# EAGLE design board2 (EAGLE 9.6.2)
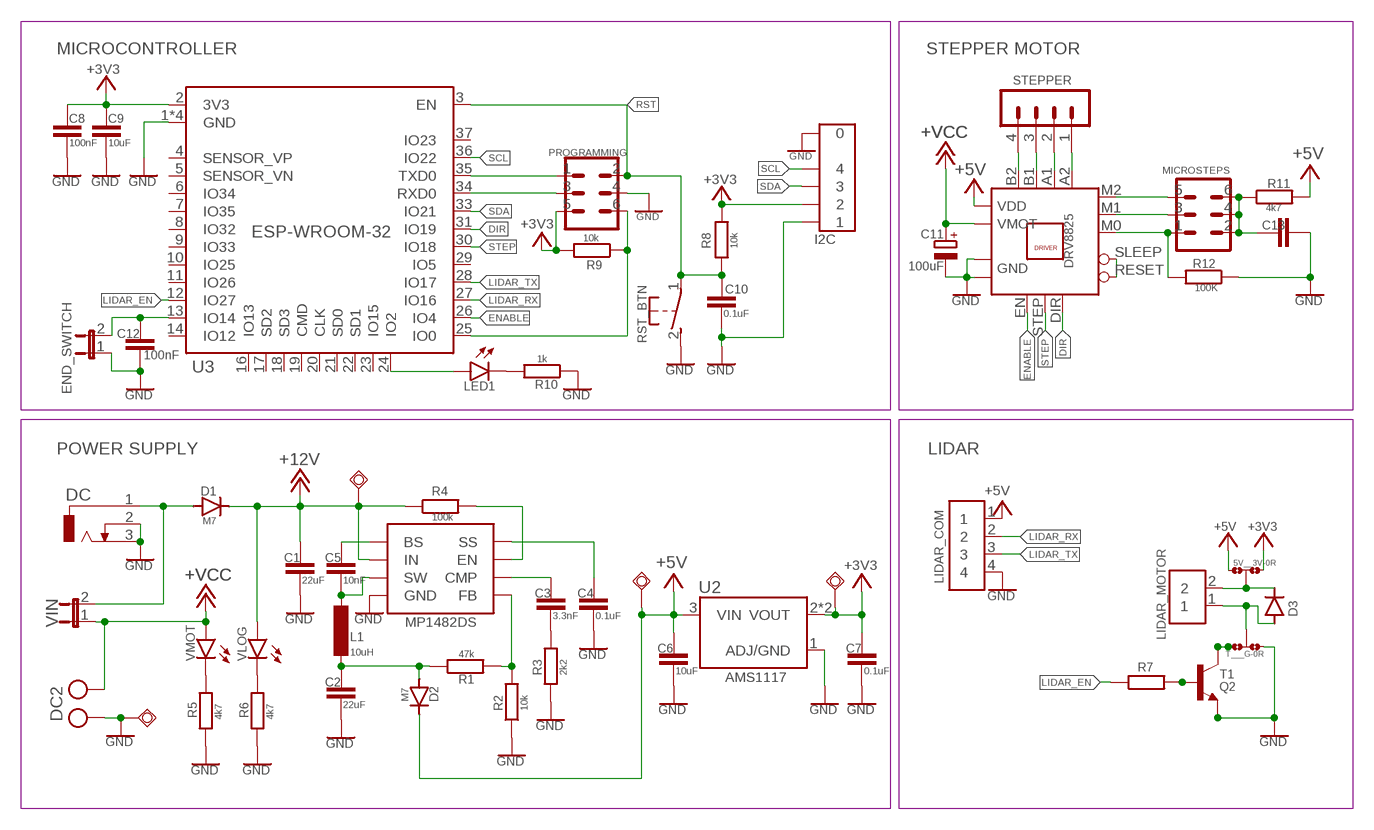
[diagram p0: schematic, sheet 1]

## Parts
3V3  TPSQTP07R  [TP07R]
5V  TPSQTP07R  [TP07R]
5V__3V  0R-JUMPA  [A0R-JMP]
12V  TPSQTP07R  [TP07R]
C1  22uF  C-EUC1210K  [C1210K]
C2  22uF  C-EUC1210K  [C1210K]
C3  3.3nF  C-EUC0805K  [C0805K]
C4  0.1uF  C-EUC0805K  [C0805K]
C5  10nF  C-EUC0805K  [C0805K]
C6  10uF  C-EUC1210K  [C1210K]
C7  0.1uF  C-EUC1210K  [C1210K]
C8  100nF  C-EUC0805K  [C0805K]
C9  10uF  C-EUC1210K  [C1210K]
C10  0.1uF  C-EUC0805K  [C0805K]
C11  100uF  CPOL-EUE3.5-8  [E3,5-8]
C12  100nF  C-EUC0805K  [C0805K]
C13  C-EUC0805K  [C0805K]
D1  M7  DIODE-DO-214AC  [DO-214AC]
D2  M7  DIODE-DO-214AC  [DO-214AC]
D3  M7  DIODE-DO-214AC  [DO-214AC]
DC  DCJ0202  [DCJ0202]
DC2  DC2  AK500/2-H  [AK500/2-H]
DRIVER  DRV8825_PCB  [DRV8825_PCB]
DRV8825  DRV8825_H  [DRV8825_H]
END_SWITCH  END_SWITCH  JP1E  [JP1]
GND  TPSQTP07R  [TP07R]
I2C  SM04B-SRSS-TB(LF)(SN)  [JST_SM04B-SRSS-TB(LF)(SN)]
L1  10uH  L-EUL5650M  [L5650M]
LED1  0  LEDCHIP-LED0805  [CHIP-LED0805]
LIDAR_COM  4PIN  [B4B-PH-K-S]
LIDAR_MOTOR  2PIN  [B2B-PH-K-S]
MICROSTEPS  MicroSteps  MA03-2  [MA03-2]
PROGRAMMING  Programming  MA03-2  [MA03-2]
Q2  BC846ALT1SMD  [SOT23]
R1  47k  R-EU_R0805W  [R0805W]
R2  10k  R-EU_R0805W  [R0805W]
R3  2k2  R-EU_R0805W  [R0805W]
R4  100k  R-EU_R0805W  [R0805W]
R5  4k7  R-EU_R0805W  [R0805W]
R6  4k7  R-EU_R0805W  [R0805W]
R7  R  R-EU_R0805W  [R0805W]
R8  10k  R-EU_R0805W  [R0805W]
R9  10k  R-EU_R0805W  [R0805W]
R10  1k  R-EU_R0805W  [R0805W]
R11  4k7  R-EU_R0805W  [R0805W]
R12  100K  R-EU_R0805W  [R0805W]
RST_BTN  DTSM-3  [DTSM-3]
STEPPER  Stepper  MA04-1  [MA04-1]
T1  BD139_BCXXX  BDBC  [TO126+TO92]
T___G  0R-JUMPB  [B0R-JMP]
U1  MP1482DS  [SOIC127P600X175-8N]
U2  AMS1117  [SOT229P700X180-4N]
U3  ESP-WROOM-32  [ESP-WROOM-32]
VIN  JUMPER  JP1E  [JP1]
VLOG  00  LEDCHIP-LED0805  [CHIP-LED0805]
VMOT  00  LEDCHIP-LED0805  [CHIP-LED0805]

## Nets
+3V3: 3V3.TP 5V__3V.1 5V__3V.2 C7.1 C8.1 C9.1 D3.C I2C.2 LIDAR_MOTOR.2 PROGRAMMING.5 R8.1 R9.2 U2.2(VOUT) U2.4(VOUT) U3.2(3V3)
+5V: 5V.TP 5V__3V.3 C6.2 D2.C DRV8825.FAULT(VDD) LIDAR_COM.1 R11.2 U2.3(VIN)
+12V: 12V.TP C1.2 D1.C R4.1 U1.2(IN) VLOG.A
+VCC: C11.+ DC2.2 DRV8825.VMOT DRV8825.VMOT1(VMOT) VIN.1 VMOT.A
A1: DRV8825.A1 STEPPER.2
A2: DRV8825.A2 STEPPER.1
B1: DRV8825.B1 STEPPER.3
B2: DRV8825.B2 STEPPER.4
BS: C5.2 U1.1(BS)
CMP: C3.2 U1.6(CMP)
DIR: DRV8825.DIR U3.31(IO19)
EN: R4.2 U1.7(EN)
ENABLE: DRV8825.EN U3.26(IO4)
END_SW: C12.2 END_SWITCH.2 U3.13(IO14)
GND: C1.1 C2.2 C4.1 C6.1 C7.2 C8.2 C9.2 C10.2 C11.- C12.1 C13.2 DC2.1 DC.2 DC.3 DRV8825.GND DRV8825.GND1(GMOT) END_SWITCH.1 GND.TP I2C.1 I2C.S1 I2C.S2 LIDAR_COM.4 PROGRAMMING.4 Q2.2(E) R2.1 R3.1 R5.1 R6.1 R10.1 R12.1 RST_BTN.2 T1.E T1.E1(E) T___G.3 U1.4(GND) U2.1(ADJ/GND) U3.1(GND) U3.15(GND) U3.38(GND) U3.GND
IO0: PROGRAMMING.6 R9.1 U3.25(IO0)
IO2: LED1.A U3.24(IO2)
LIDAR_EN: R7.1 U3.12(IO27)
LIDAR_RX: LIDAR_COM.2 U3.27(IO16)
LIDAR_TX: LIDAR_COM.3 U3.28(IO17)
M0: DRV8825.M0 MICROSTEPS.1 R12.2
M1: DRV8825.M1 MICROSTEPS.3
M2: DRV8825.M2 MICROSTEPS.5
MT: D3.A LIDAR_MOTOR.1 T___G.2
N$1: C2.1 D2.A L1.1 R1.1
N$2: C3.1 R3.2
N$3: R5.2 VMOT.C
N$4: Q2.3(C) T1.C T___G.1
N$5: C13.1 MICROSTEPS.2 MICROSTEPS.4 MICROSTEPS.6 R11.1
N$6: LED1.C R10.2
N$7: R6.2 VLOG.C
N$8: R1.2 R2.2 U1.5(FB)
N$9: DRV8825.RESET DRV8825.SLEEP
N$12: Q2.1(B) R7.2 T1.B
RST: C10.1 PROGRAMMING.2 R8.2 RST_BTN.1 U3.3(EN)
RXD: PROGRAMMING.3 U3.34(RXD0)
SCL: I2C.4 U3.36(IO22)
SDA: I2C.3 U3.33(IO21)
SS: C4.2 U1.8(SS)
STEP: DRV8825.STEP U3.30(IO18)
SW: C5.1 L1.2 U1.3(SW)
TXD: PROGRAMMING.1 U3.35(TXD0)
VIN: D1.A DC.1 VIN.2
Unconnected: U3.4(SENSOR_VP) U3.5(SENSOR_VN) U3.6(IO34) U3.7(IO35) U3.8(IO32) U3.9(IO33) U3.10(IO25) U3.11(IO26) U3.14(IO12) U3.16(IO13) U3.17(SD2) U3.18(SD3) U3.19(CMD) U3.20(CLK) U3.21(SD0) U3.22(SD1) U3.23(IO15) U3.29(IO5) U3.37(IO23)

## Notes on the sheet
- MICROCONTROLLER | STEPPER MOTOR
- POWER SUPPLY | LIDAR

## Library data of the parts
3V3 5V 12V GND = testpad:TPSQ: Test pad
5V__3V T___G = jump-0r-smd:0R-JUMP: SMD 0R 0805 Jumper
C1-C10 C12 C13 = rcl:C-EU: CAPACITOR, European symbol; SPICEPREFIX: C
C11 = rcl:CPOL-EU: POLARIZED CAPACITOR, European symbol; SPICEPREFIX: C
D1-D3 = diode:DIODE-: DIODE
DC = con-jack:DCJ0202: DC POWER JACK Source: DCJ0202.pdf; OC_FARNELL: unknown; OC_NEWARK: unknown
DC2 = con-ptr500:AK500/2-H: CONNECTOR Aug. 2004 / PTR Meßtechnik: Die Bezeichnung der Serie AK505 wurde geändert. Es handelt sich hierbei um AK500 in horizontaler Ausführung.; OC_FARNELL: unknown; OC_NEWARK: unknown
DRIVER = drv8825:DRV8825_PCB
DRV8825 = drv8825:DRV8825_H
END_SWITCH VIN = jumper:JP1E: JUMPER
I2C = SM04B-SRSS-TB_LF__SN_:SM04B-SRSS-TB(LF)(SN): SH Series 1.0 mm Pitch 2 Position Single Row Side Entry Shrouded Header Check availability <https://pricing.snapeda.com/parts/SM04B-SRSS-TB%28LF%29%28SN%29/JST%20Sales/view-part?ref=eda>; AVAILABILITY: In Stock; DESCRIPTION: Connector Header Surface Mount, Right Angle 4 position 0.039 (1.00mm); MF: JST Sales; MP: SM04B-SRSS-TB(LF)(SN); PACKAGE: None; PRICE: None; PURCHASE-URL: https://pricing.snapeda.com/search?q=SM04B-SRSS-TB(LF)(SN)&ref=eda
L1 = rcl:L-EU: INDUCTOR, European symbol; SPICEPREFIX: L
LED1 VLOG VMOT = led:LED: LED OSRAM: - CHIPLED LG R971, LG N971, LY N971, LG Q971, LY Q971, LO R971, LY R971 LH N974, LH R974 LS Q976, LO Q976, LY Q976 LO Q996 - Hyper CHIPLED LW Q18S LB Q993, LB Q99A, LB R99A - SideLED LS A670, LO A670, LY A670, LG A670, LP A670 LB A673, LV A673, LT A673, LW A673 LH A674 LY A675 LS A676, LA A676, LO A676, LY A676, LW A676 LS A679, LY A679, LG A679 - Hyper Micro SIDELED® LS Y876, LA Y876, LO Y876, LY Y876 LT Y87S - SmartLED LW L88C, LW L88S LB L89C, LB L89S, LG L890 LS L89K, LO L89K, LY L89K LS L896, LA L896, LO L896, LY L896 - TOPLED LS T670, LO T670, LY T670, LG T670, LP T670 LSG T670, LSP T670, LSY T670, LOP T670, LYG T670 LG T671, LOG T671, LSG T671 LB T673, LV T673, LT T673, LW T673 LH T674 LS T676, LA T676, LO T676, LY T676, LB T676, LH T676, LSB T676, LW T676 LB T67C, LV T67C, LT T67C, LS T67K, LO T67K, LY T67K, LW E67C LS E67B, LA E67B, LO E67B, LY E67B, LB E67C, LV E67C, LT E67C LW T67C LS T679, LY T679, LG T679 LS T770, LO T770, LY T770, LG T770, LP T770 LB T773, LV T773, LT T773, LW T773 LH T774 LS E675, LA E675, LY E675, LS T675 LS T776, LA T776, LO T776, LY T776, LB T776 LHGB T686 LT T68C, LB T68C - Hyper Mini TOPLED® LB M676 - Mini TOPLED Santana® LG M470 LS M47K, LO M47K, LY M47K Source: http://www.osram.convergy.de LUXEON: - LUMILED® LXK2-PW12-R00, LXK2-PW12-S00, LXK2-PW14-U00, LXK2-PW14-V00 LXK2-PM12-R00, LXK2-PM12-S00, LXK2-PM14-U00 LXK2-PE12-Q00, LXK2-PE12-R00, LXK2-PE12-S00, LXK2-PE14-T00, LXK2-PE14-U00 LXK2-PB12-K00, LXK2-PB12-L00, LXK2-PB12-M00, LXK2-PB14-N00, LXK2-PB14-P00, LXK2-PB14-Q00 LXK2-PR12-L00, LXK2-PR12-M00, LXK2-PR14-Q00, LXK2-PR14-R00 LXK2-PD12-Q00, LXK2-PD12-R00, LXK2-PD12-S00 LXK2-PH12-R00, LXK2-PH12-S00 LXK2-PL12-P00, LXK2-PL12-Q00, LXK2-PL12-R00 Source: www.luxeon.com KINGBRIGHT: KA-3528ASYC Source: www.kingbright.com
LIDAR_COM = jst_eph:4PIN
LIDAR_MOTOR = jst_eph:2PIN
MICROSTEPS PROGRAMMING = con-lstb:MA03-2: PIN HEADER; OC_FARNELL: unknown; OC_NEWARK: unknown
Q2 = transistor-npn:BC846*: NPN Transistor
R1-R12 = rcl:R-EU_: RESISTOR, European symbol; SPICEPREFIX: R
RST_BTN = switch-tact:DTSM-3
STEPPER = con-lstb:MA04-1: PIN HEADER; OC_FARNELL: unknown; OC_NEWARK: unknown
T1 = transistor-power:BDBC
U1 = SOIC127P600X175-8N:MP1482DS; MP1482DS: MP1482DS
U2 = AMS1117:AMS1117: Sot223/Pkg 1-Amp 5-Volt Low Drop Out Voltage Regulatator Check availability <https://pricing.snapeda.com/parts/AMS1117/Advanced%20Monolithic%20Systems/view-part?ref=eda>; AVAILABILITY: Not in stock; DESCRIPTION: 1A LOW DROPOUT VOLTAGE REGULATOR SOT-223; MF: Advanced Monolithic Systems; MP: AMS1117; PACKAGE: SOT-223 Seeed Technology; PRICE: None
U3 = esp32_smd:ESP-WROOM-32: Espressif Systems ESP-WROOM-32

## Board
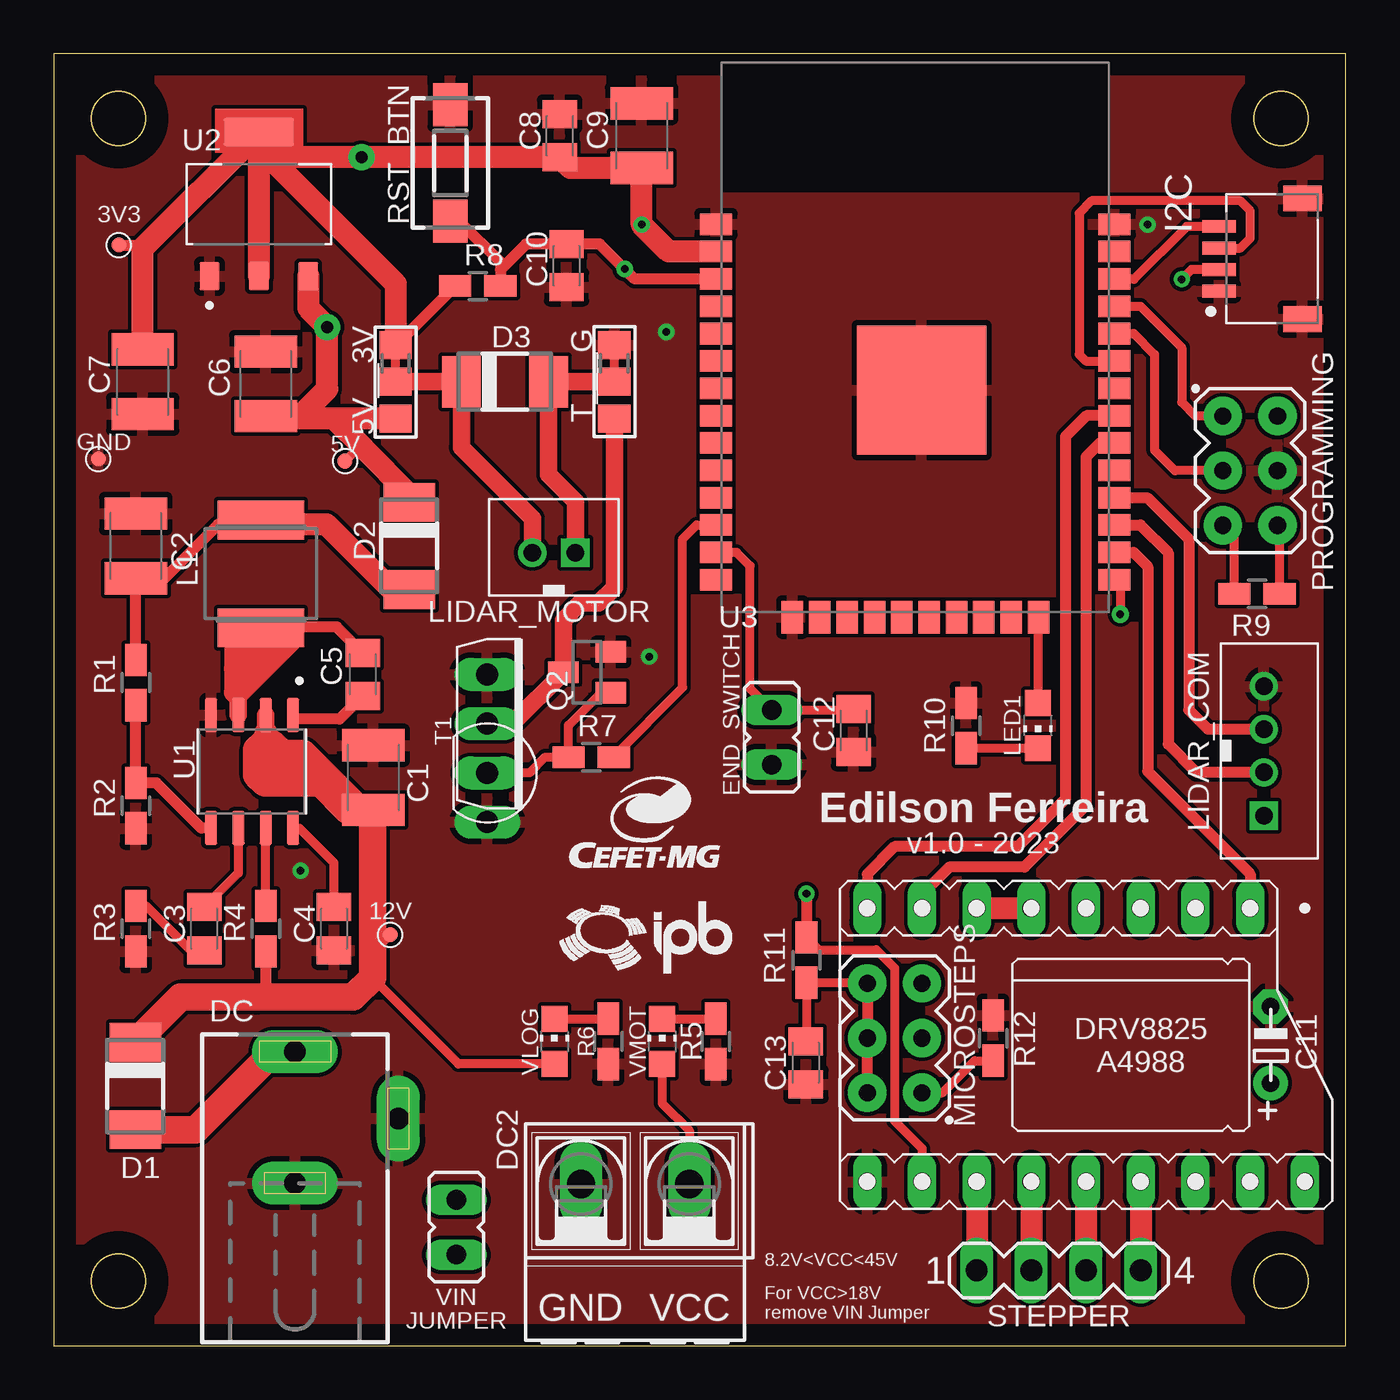
[diagram p1: board, top side]
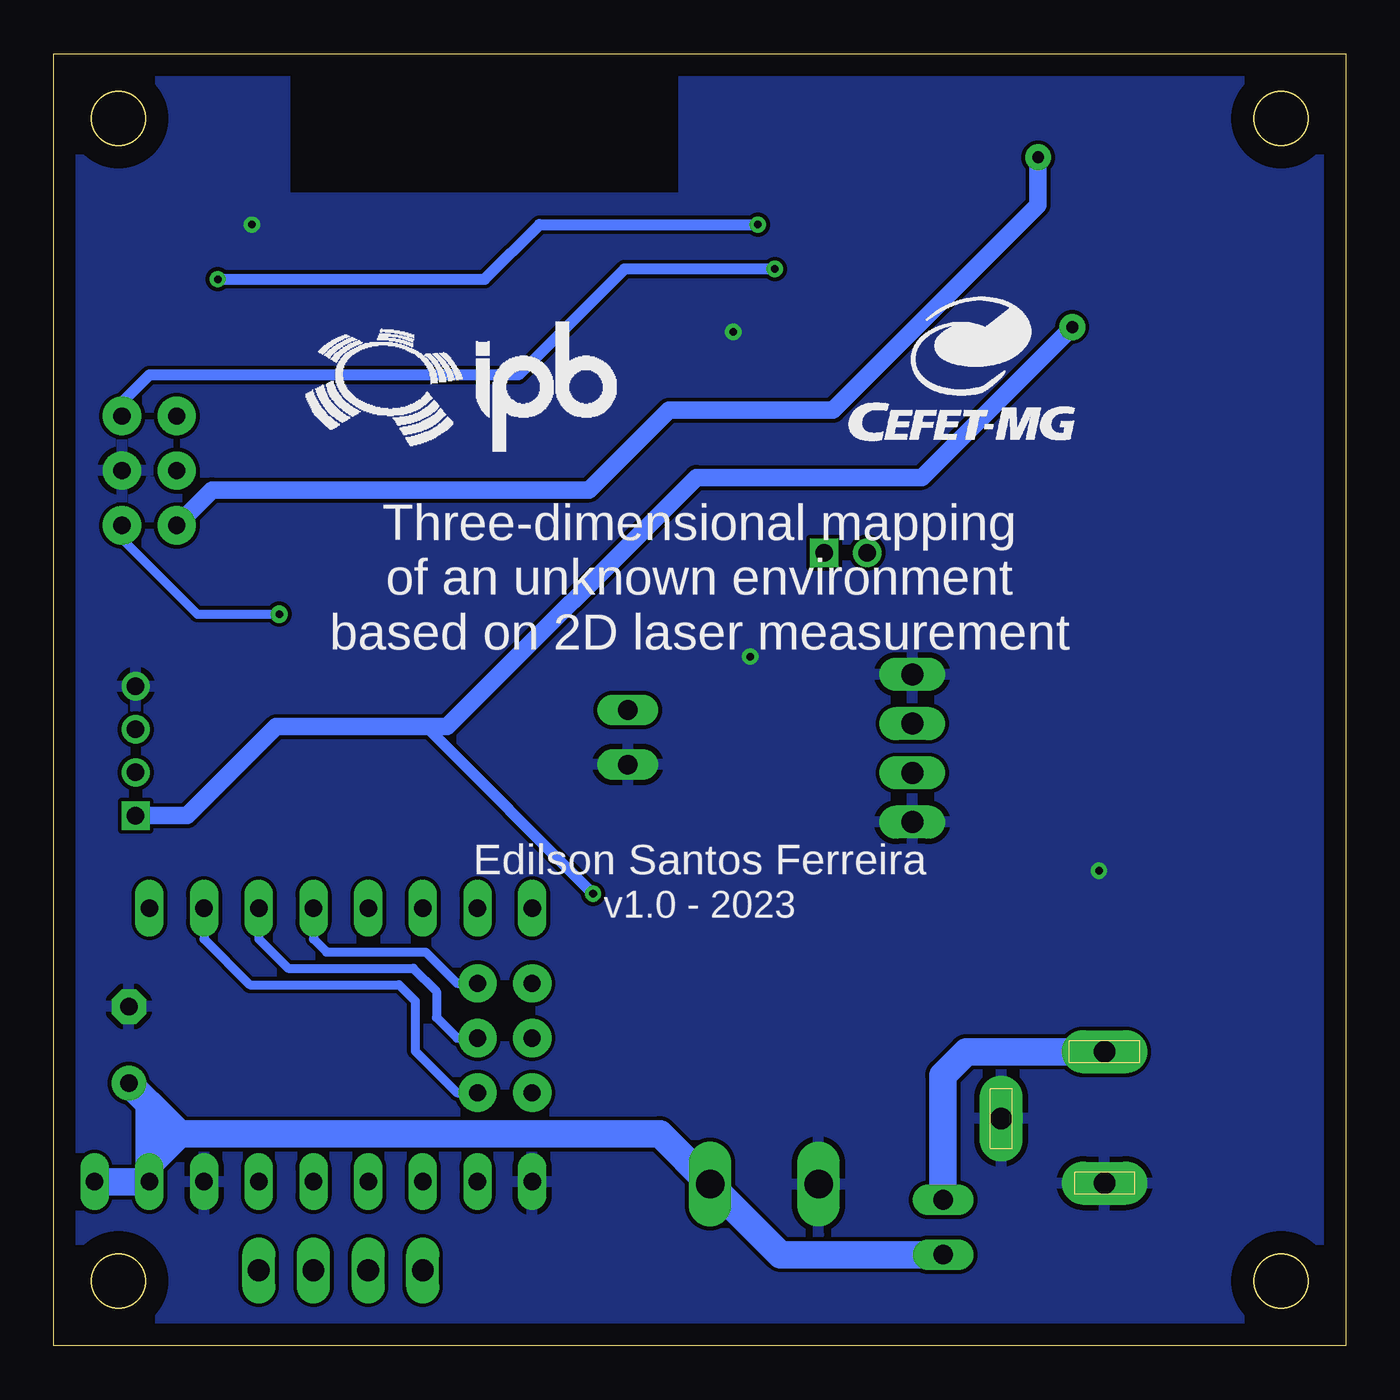
[diagram p2: board, bottom side, seen from below]

Size 60 x 60 mm. Coordinates in mm from the lower left corner, seen from the top.
Outline: 0,0 60,0 60,60 0,60 0,0
Outline: circle at 57,3 radius 1.25
Outline: circle at 3,3 radius 1.25
Outline: circle at 3,57 radius 1.25
Outline: circle at 57,57 radius 1.25
Copper layers (1*16): Top 0.035mm / dielectric 1.5mm / Bottom 0.035mm
Design rules "default *": minimum track width 6mil, minimum drill 0.35mm, track to track 7mil, track to pad 6mil, pad to pad 7mil, via to via 7mil, smd to smd 6mil, copper to edge 40mil, drill to drill 6mil, minimum pad ring 10mil, minimum via ring 8mil, stop-mask expansion 4mil, vias tented up to drill 0mil, thermal gap 10mil

### Footprints (pad centres in the part's own frame; a part is rotated, then mirrored left to right if it is on the bottom)
TP07R = smd 0.7 x 0.7: TP 0,0
A0R-JMP = smd 1.5 x 1.3: 1 0,1.7; 2 0,0; 3 0,-1.7
C1210K = smd 1.5 x 2.9: 1 -1.5,0; 2 1.5,0
C0805K = smd 1.3 x 1.6: 1 -1,0; 2 1,0
E3,5-8 = drill 0.813 pad 1.6: + -1.778,0 | drill 0.813 pad 1.6 octagon: - 1.778,0
DO-214AC = smd 1.8 x 2.4: A 2.025,0; C -2.025,0
DCJ0202 = drill 1 pad 2 long: 1 0,3.1; 2 4.8,0; 3 0,-3
AK500/2-H = drill 1.321 long: 1 -2.515,0; 2 2.515,0
DRV8825_H = drill 0.813 long: A1 6.35,-1.27; A2 6.35,-3.81; B1 6.35,1.27; B2 6.35,3.81; DIR -6.35,-8.89; EN -6.35,8.89; FAULT 6.35,-6.35; GND 6.35,-8.89; GND1 6.35,6.35; M0 -6.35,6.35; M1 -6.35,3.81; M2 -6.35,1.27; RESET -6.35,-1.27; SLEEP -6.35,-3.81; STEP -6.35,-6.35; VMOT 6.35,8.89; VMOT1 6.35,11.43
JP1 = drill 0.914 long: 1 0,-1.27; 2 0,1.27
JST_SM04B-SRSS-TB(LF)(SN) = smd 0.6 x 1.55: 1 -1.5,0; 2 -0.5,0; 3 0.5,0; 4 1.5,0 | smd 1.2 x 1.8: S1 -2.8,-3.875; S2 2.8,-3.875
L5650M = smd 1.8 x 4: 1 -2.5,0; 2 2.5,0
CHIP-LED0805 = smd 1.2 x 1.2: A 0,-1.05; C 0,1.05
B4B-PH-K-S = drill 0.813 square: 1 3,0 | drill 0.813: 2 1,0; 3 -1,0; 4 -3,0
B2B-PH-K-S = drill 0.813 square: 1 2,0 | drill 0.813: 2 0,0
MA03-2 = drill 0.8 pad 1.778: 1 -2.54,-1.27; 2 -2.54,1.27; 3 0,-1.27; 4 0,1.27; 5 2.54,-1.27; 6 2.54,1.27
SOT23 = smd 1 x 1.4: 1 -0.95,-1.1; 2 0.95,-1.1; 3 0,1.1
R0805W = smd 1.5 x 1: 1 -1.052,0; 2 1.052,0
DTSM-3 = smd 2 x 1.6: 1 -2.7,0; 2 2.7,0
MA04-1 = drill 1.016 long: 1 -3.81,0; 2 -1.27,0; 3 1.27,0; 4 3.81,0
TO126+TO92 = drill 1.016 long: B 1.143,-1.27; C -1.143,-1.27; E -3.429,-1.27; E1 3.429,-1.27
B0R-JMP = smd 1.5 x 1.3: 1 0,1.7; 2 0,0; 3 0,-1.7
SOIC127P600X175-8N = smd 1.58 x 0.59: 1 -2.625,1.905; 2 -2.625,0.635; 3 -2.625,-0.635; 4 -2.625,-1.905; 5 2.625,-1.905; 6 2.625,-0.635; 7 2.625,0.635; 8 2.625,1.905
SOT229P700X180-4N = smd 1.31 x 0.93: 1 -3.345,2.29; 2 -3.345,0; 3 -3.345,-2.29 | smd 1.31 x 3.24: 4 3.345,0
ESP-WROOM-32 = smd 1.5 x 1: 1 -9.25,7; 2 -9.25,5.73; 3 -9.25,4.46; 4 -9.25,3.19; 5 -9.25,1.92; 6 -9.25,0.65; 7 -9.25,-0.62; 8 -9.25,-1.89; 9 -9.25,-3.16; 10 -9.25,-4.43; 11 -9.25,-5.7; 12 -9.25,-6.97; 13 -9.25,-8.24; 14 -9.25,-9.51; 25 9.25,-9.51; 26 9.25,-8.24; 27 9.25,-6.97; 28 9.25,-5.7; 29 9.25,-4.43; 30 9.25,-3.16; 31 9.25,-1.89; 32 9.25,-0.62; 33 9.25,0.65; 34 9.25,1.92; 35 9.25,3.19; 36 9.25,4.46; 37 9.25,5.73; 38 9.25,7 | smd 1 x 1.5: 15 -5.7,-11.25; 16 -4.43,-11.25; 17 -3.16,-11.25; 18 -1.89,-11.25; 19 -0.62,-11.25; 20 0.65,-11.25; 21 1.92,-11.25; 22 3.19,-11.25; 23 4.46,-11.25; 24 5.73,-11.25 | smd 6 x 6: GND 0.3,-0.7

### Placement (x,y rotation side)
3V3  3.02,51.12 0 top
5V  13.53,41.08 0 top
5V__3V  15.88,44.77 0 top
12V  15.62,19.08 0 top
C1  14.84,26.38 270 top
C2  3.81,37.15 90 top
C3  6.99,19.37 90 top
C4  13.02,19.37 90 top
C5  14.35,31.18 270 top
C6  9.84,44.67 270 top
C7  4.13,44.77 270 top
C8  23.5,56.2 90 top
C9  27.3,56.2 90 top
C10  23.81,50.16 270 top
C11  56.52,13.97 90 top
C12  37.15,28.57 90 top
C13  34.92,13.14 270 top
D1  3.79,12.06 270 top
D2  16.51,37.15 270 top
D3  20.95,44.77 0 top
DC  11.2,10.55 0 top
DC2  27,7.5 0 top
DRIVER  50.48,13.97 270 top
DRV8825  46.67,13.97 270 top
END_SWITCH  33.34,28.26 0 top
GND  2.06,41.18 0 top
I2C  54.12,50.48 90 top
L1  9.62,35.85 270 top
LED1  45.71,28.8 180 top
LIDAR_COM  56.2,27.62 270 top
LIDAR_MOTOR  22.23,36.83 0 top
MICROSTEPS  39.05,14.29 90 top
PROGRAMMING  55.56,40.64 270 top
Q2  24.77,31.27 90 top
R1  3.81,30.8 270 top
R2  3.81,25.08 90 top
R3  3.81,19.37 90 top
R4  9.84,19.37 90 top
R5  30.75,14.13 90 top
R6  25.75,14.13 90 top
R7  24.96,27.34 180 top
R8  19.68,49.21 0 top
R9  55.88,34.92 180 top
R10  42.37,28.8 270 top
R11  34.96,17.91 90 top
R12  43.62,14.29 270 top
RST_BTN  18.41,54.93 90 top
STEPPER  46.67,3.49 0 top
T1  21.4,27.75 270 top
T___G  26.04,44.77 180 top
U1  9.21,26.67 270 top
U2  9.53,53.02 90 top
U3  40.01,45.09 0 top
VIN  18.7,5.5 0 top
VLOG  23.25,14.13 0 top
VMOT  28.25,14.13 0 top

### Tracks (layer width: path | path; a pad name or v marks a point on that pad's centre or on a via)
+3V3  (via drill 0.35, 0.55 pad 1.2)
  Top 0.406: PROGRAMMING.5 54.83,37.56 R9.2 | I2C.2 52.84,49.98 v52.39,49.53 | 5V__3V.2 5V__3V.1
  Top 0.508: 3V3.TP 3.98,51.12 4.13,50.97 | R8.1 5V__3V.1
  Top 0.813: 5V__3V.2 D3.C 18.93,41.71 22.23,38.42 LIDAR_MOTOR.2
  Top 1.016: U2.2 9.53,55.67 | 9.53,55.67 U2.4 | C7.1 4.13,50.97 U2.4 | 5V__3V.1 15.88,49.33 9.53,55.67 | U3.2 28.56,50.81 v27.3,52.07 C9.1 24,54.7 C8.1 v14.29,55.2 10.7,55.2 U2.4
  Bottom 0.508: v52.39,49.53 39.99,49.53 37.45,52.07 v27.3,52.07
  Bottom 0.813: v14.29,55.2 14.29,52.98 23.81,43.45 31.43,43.45 35.14,39.75 52.65,39.75 PROGRAMMING.5
+5V  (via drill 0.35, 0.55 pad 1.2)
  Top 0.406: DRV8825.FAULT 40.32,9.16 39.05,10.43 39.05,17.54 38.2,18.39 35.53,18.39 R11.2 | 5V.TP 14.08,41.64 14.43,41.64
  Top 0.508: v34.96,20.99 R11.2
  Top 1.016: 5V__3V.3 13,43.07 | D2.C 16.51,39.55 14.43,41.64 13,43.07 | 13,43.07 9.95,43.07 C6.2 11.44,43.17 12.7,44.44 v12.7,47.31 11.81,48.19 U2.3
  Bottom 0.508: v34.96,20.99 42.72,28.75 43.01,28.75
  Bottom 0.813: LIDAR_COM.1 53.8,24.62 49.67,28.75 43.01,28.75 41.73,28.75 30.16,40.32 19.68,40.32 v12.7,47.31
+12V
  Top 0.406: 9.84,16.61 9.43,16.19 | 12V.TP 14.8,18.26 14.8,17.78 | VLOG.A 18.8,13.08 14.8,17.08
  Top 0.508: R4.1 9.84,16.61
  Top 0.813: 9.84,28.51 U1.2
  Top 1.016: 9.72,27.97 9.84,28.1 9.84,28.51
  Top 1.27: C1.2 13.63,24.88 12.38,26.13 9.81,26.13 9.43,26.51 9.43,26.92 | 9.43,26.92 9.43,27.69 9.72,27.97 10.13,27.97 10.6,27.5 11.59,27.5 14.2,24.88 C1.2 | 9.43,26.92 11.27,26.92 | C1.2 14.8,24.84 14.8,17.78 14.8,17.08 13.9,16.19 9.43,16.19 5.89,16.19 D1.C
+VCC
  Top 0.406: VMOT.A 28.25,11.26 29.52,10 DC2.2
  Bottom 1.27: 54.14,9.84 55.56,8.42 DRV8825.VMOT | C11.+ 55.56,11.24 | DRV8825.VMOT 55.56,11.24 | DRV8825.VMOT1 DRV8825.VMOT | 55.56,11.24 55.54,11.24 54.14,9.84 | 54.14,9.84 31.86,9.84 DC2.2 26.25,4.23 VIN.1
A1
  Top 1.016: DRV8825.A1 STEPPER.2
A2
  Top 1.016: DRV8825.A2 STEPPER.1
B1
  Top 1.016: DRV8825.B1 STEPPER.3
B2
  Top 1.016: DRV8825.B2 STEPPER.4
BS
  Top 0.508: C5.2 13.27,29.1 11.31,29.1 U1.1
CMP
  Top 0.406: U1.6 8.57,21.95 C3.2
DIR
  Top 0.508: U3.31 47.96,43.2 46.99,42.23 46.99,25.4 44.77,23.18 39.05,23.18 37.78,21.91 DRV8825.DIR
EN
  Top 0.406: R4.2 U1.7
ENABLE
  Top 0.508: U3.26 50.15,36.84 50.8,36.2 50.8,26.67 55.56,21.91 DRV8825.EN
END_SW
  Top 0.406: 37.1,29.53 END_SWITCH.2 32.34,30.52 32.34,36.21 31.71,36.84 U3.13
  Top 0.508: 37.1,29.53 C12.2
GND  (via drill 0.35)
  other vias: 50.8,52.07 27.65,32 28.45,47.09 11.46,22.07
  pour Top: 0,0 0,60.01 60.01,60.01 60.01,0
  pour Bottom: 0,0 0,60.01 60.01,60.01 60.01,0
IO0  (via drill 0.35 pad 0.8)
  Top 0.406: U3.25 49.53,35.3 v49.53,33.97 | PROGRAMMING.6 56.93,38 R9.1
  Bottom 0.406: PROGRAMMING.6 56.83,37.47 53.34,33.97 v49.53,33.97
IO2
  Top 0.406: LED1.A 45.73,29.88 U3.24
LIDAR_EN
  Top 0.406: U3.12 29.86,38.12 29.21,37.47 29.21,30.57 26.01,27.37 R7.1
LIDAR_RX
  Top 0.508: U3.27 50.47,38.12 51.75,36.83 51.75,27.94 53.07,26.62 LIDAR_COM.2
LIDAR_TX
  Top 0.508: U3.28 50.78,39.38 52.7,37.47 52.7,29.53 53.61,28.62 LIDAR_COM.3
M0
  Top 0.406: MICROSTEPS.1 41.27,11.75 42.76,13.23 R12.2
  Bottom 0.406: DRV8825.M0 53.02,18.89 50.9,16.76 43.97,16.76 43.21,16 43.21,13.68 41.27,11.75 MICROSTEPS.1
M1
  Bottom 0.406: DRV8825.M1 50.48,18.89 49.12,17.53 43.31,17.53 42.23,16.45 42.23,15.24 41.27,14.29 MICROSTEPS.3
M2
  Bottom 0.406: DRV8825.M2 47.94,18.89 47.34,18.29 42.74,18.29 41.27,16.83 MICROSTEPS.5
MT
  Top 0.813: LIDAR_MOTOR.1 24.23,39.21 22.98,40.46 D3.A T___G.2
N$1
  Top 0.508: 9.83,38.14 7.63,38.14 5.14,35.65 C2.1 R1.1
  Top 1.016: D2.A 15.68,35.12 12.67,38.14 9.83,38.14 L1.1
N$2
  Top 0.406: C3.1 6.35,18.37 4.3,20.42 R3.2
N$3
  Top 0.406: VMOT.C R5.2
N$4
  Top 0.813: T1.C 21.28,28.89 Q2.3 23.66,33.7 24.45,34.48 25.3,34.48 26.04,35.21 T___G.1
N$5
  Top 0.406: C13.1 34.96,14.18 R11.1 37.76,16.86
  Top 0.508: MICROSTEPS.2 MICROSTEPS.4 MICROSTEPS.6 37.76,16.86
N$6
  Top 0.406: LED1.C 45.69,27.73 R10.2
N$7
  Top 0.406: VLOG.C R6.2
N$8
  Top 0.508: R1.2 R2.2 4.76,26.14 6.85,24.05 U1.5
N$9
  Top 1.016: DRV8825.SLEEP DRV8825.RESET
N$12
  Top 0.406: T1.B 22.09,26.61 22.82,27.34 R7.2 23.9,28.81 25.42,30.32 Q2.1
RST  (via drill 0.35)
  Top 0.508: RST_BTN.1 18.83,52.23 20.74,50.32 20.74,49.97 | 20.74,49.97 R8.2 | 20.74,49.97 21.93,51.16 C10.1 25.35,51.16 v26.51,50.01 26.97,49.55 U3.3
  Bottom 0.508: v26.51,50.01 33.5,50.01 38.42,45.09 55.56,45.09 56.83,43.81 PROGRAMMING.2
RXD
  Top 0.406: U3.34 50.15,47.01 51.12,46.04 51.12,41.59 52.07,40.64 PROGRAMMING.3
SCL
  Top 0.406: I2C.4 52.62,51.98 50.16,49.53 49.27,49.53 U3.36
SDA
  Top 0.406: I2C.3 55.11,50.98 55.56,51.44 55.56,52.7 55.1,53.17 48.2,53.17 47.62,52.6 47.62,46.04 47.93,45.73 U3.33
SS
  Top 0.406: C4.2 13.02,22.43 11.4,24.05 U1.8
STEP
  Top 0.508: U3.30 48.59,41.92 47.94,41.27 47.94,25.08 45.09,22.23 41.59,22.23 40.32,20.95 DRV8825.STEP
SW
  Top 0.406: 11.11,33.38 9.66,33.38 L1.2
  Top 0.508: C5.1 13.14,33.38 11.11,33.38
  Top 0.813: U1.3 8.57,30.19 8.51,30.26
  Top 1.016: 11.11,33.38 11.11,32.86 8.51,30.26 8.41,30.35 8.41,31.43 | 8.41,31.43 9.62,32.64 L1.2 8.61,33.35 8.41,33.15 8.41,31.43
TXD
  Top 0.406: PROGRAMMING.1 53.02,43.18 52.39,43.81 52.39,46.35 50.47,48.27 U3.35
VIN
  Top 1.27: D1.A 6.6,10.04 10.21,13.65 DC.1
  Bottom 1.27: DC.1 17.62,13.65 18.71,12.56 18.71,6.78 VIN.2
(copper drawn outside any net)
  shapes: Top area x2

### Text on the board
tPlace: Edilson Ferreira | v1.0 - 2023 | GND | VCC
bPlace: Three-dimensional mapping / of an unknown environment / based on 2D laser measurement | Edilson Santos Ferreira | v1.0 - 2023
tNames: 8.2V<VCC<45V | JUMPER | For VCC>18V / remove VIN Jumper